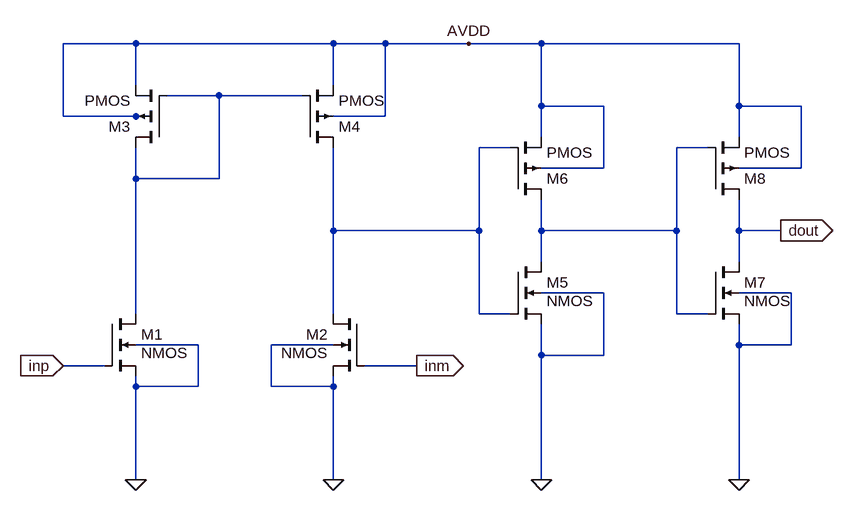
[diagram p0: schematic zc_cmp.asc]
zc_cmp.asc, the LTspice schematic file:
Version 4
SHEET 1 1464 708
WIRE 336 -176 224 -176
WIRE 640 -176 336 -176
WIRE 720 -176 640 -176
WIRE 848 -176 720 -176
WIRE 960 -176 848 -176
WIRE 1264 -176 960 -176
WIRE 336 -112 336 -176
WIRE 640 -112 640 -176
WIRE 464 -96 384 -96
WIRE 592 -96 464 -96
WIRE 960 -80 960 -176
WIRE 1056 -80 960 -80
WIRE 1264 -80 1264 -176
WIRE 1360 -80 1264 -80
WIRE 224 -64 224 -176
WIRE 336 -64 224 -64
WIRE 352 -64 336 -64
WIRE 720 -64 720 -176
WIRE 720 -64 640 -64
WIRE 960 -32 960 -80
WIRE 1264 -32 1264 -80
WIRE 912 -16 864 -16
WIRE 1216 -16 1168 -16
WIRE 1056 16 1056 -80
WIRE 1056 16 960 16
WIRE 1360 16 1360 -80
WIRE 1360 16 1264 16
WIRE 336 32 336 -16
WIRE 464 32 464 -96
WIRE 464 32 336 32
WIRE 640 112 640 -16
WIRE 864 112 864 -16
WIRE 864 112 640 112
WIRE 960 112 960 64
WIRE 1168 112 1168 -16
WIRE 1168 112 960 112
WIRE 1264 112 1264 64
WIRE 1328 112 1264 112
WIRE 960 160 960 112
WIRE 1264 160 1264 112
WIRE 1056 208 960 208
WIRE 1344 208 1264 208
WIRE 336 240 336 32
WIRE 640 240 640 112
WIRE 864 240 864 112
WIRE 912 240 864 240
WIRE 1168 240 1168 112
WIRE 1216 240 1168 240
WIRE 432 288 336 288
WIRE 640 288 544 288
WIRE 1264 288 1264 256
WIRE 1344 288 1344 208
WIRE 1344 288 1264 288
WIRE 960 304 960 256
WIRE 1056 304 1056 208
WIRE 1056 304 960 304
WIRE 288 320 224 320
WIRE 768 320 688 320
WIRE 336 352 336 336
WIRE 432 352 432 288
WIRE 432 352 336 352
WIRE 544 352 544 288
WIRE 640 352 640 336
WIRE 640 352 544 352
WIRE 336 496 336 352
WIRE 640 496 640 352
WIRE 960 496 960 304
WIRE 1264 496 1264 288
FLAG 336 496 0
FLAG 640 496 0
FLAG 224 320 inp
IOPIN 224 320 In
FLAG 768 320 inm
IOPIN 768 320 Out
FLAG 848 -176 AVDD
FLAG 960 496 0
FLAG 1264 496 0
FLAG 1328 112 dout
IOPIN 1328 112 Out
SYMBOL nmos4 288 240 R0
WINDOW 3 56 60 Left 2
SYMATTR InstName M1
SYMBOL pmos4 384 -16 R180
SYMATTR InstName M3
SYMBOL nmos4 688 240 M0
WINDOW 3 56 60 Left 2
SYMATTR InstName M2
SYMBOL pmos4 592 -16 M180
SYMATTR InstName M4
SYMBOL pmos4 912 64 M180
SYMATTR InstName M6
SYMBOL nmos4 912 160 R0
WINDOW 3 56 60 Left 2
SYMATTR InstName M5
SYMBOL pmos4 1216 64 M180
SYMATTR InstName M8
SYMBOL nmos4 1216 160 R0
WINDOW 3 56 60 Left 2
SYMATTR InstName M7

The netlist it stands for:
* zc_cmp.asc
M1 N001 inp 0 0 NMOS
M3 N001 N001 AVDD AVDD PMOS
M2 N002 inm 0 0 NMOS
M4 N002 N001 AVDD AVDD PMOS
M6 N003 N002 AVDD AVDD PMOS
M5 N003 N002 0 0 NMOS
M8 dout N003 AVDD AVDD PMOS
M7 dout N003 0 0 NMOS
.model NMOS NMOS
.model PMOS PMOS
.lib standard.mos
.backanno
.end